# EAGLE design thruster_control (EAGLE 7.2.0)
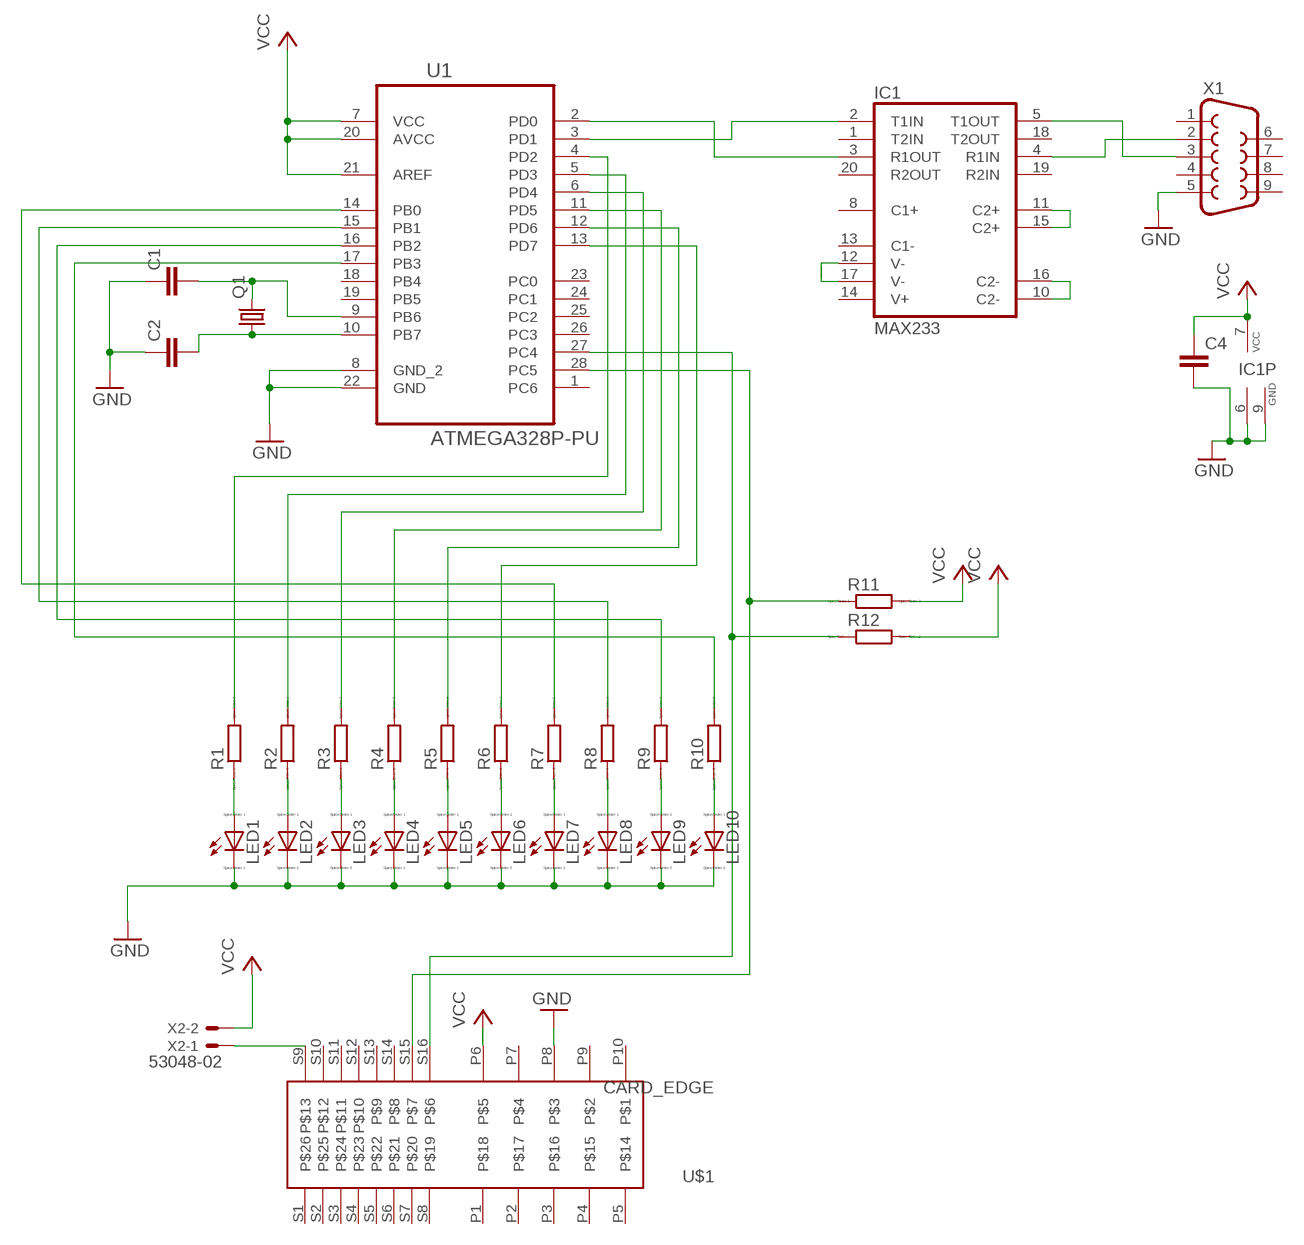
[diagram p0: schematic, sheet 1]

## Parts
C1  C2.5/4  [C2.5-4]
C2  C2.5/4  [C2.5-4]
C4  C2.5/4  [C2.5-4]
IC1  MAX233  [DIL20]
LED1  LED_ELD260  [LED_LD260]
LED2  LED_ELD260  [LED_LD260]
LED3  LED_ELD260  [LED_LD260]
LED4  LED_ELD260  [LED_LD260]
LED5  LED_ELD260  [LED_LD260]
LED6  LED_ELD260  [LED_LD260]
LED7  LED_ELD260  [LED_LD260]
LED8  LED_ELD260  [LED_LD260]
LED9  LED_ELD260  [LED_LD260]
LED10  LED_ELD260  [LED_LD260]
Q1  CRYSTALHC49S  [HC49/S]
R1  R0204/7  [0204/7]
R2  R0204/7  [0204/7]
R3  R0204/7  [0204/7]
R4  R0204/7  [0204/7]
R5  R0204/7  [0204/7]
R6  R0204/7  [0204/7]
R7  R0204/7  [0204/7]
R8  R0204/7  [0204/7]
R9  R0204/7  [0204/7]
R10  R0204/7  [0204/7]
R11  R0204/7  [0204/7]
R12  R0204/7  [0204/7]
U1  ATMEGA328P-PU  [DIP254P762X457-28]
U$1  CARD_EDGE  [EDGE_CONNECTOR]
X1  F09HP  [F09HP]
X2  53048-02  [53048-02]

## Nets
GND: C1.1 C2.1 C4.2 IC1.6(GND) IC1.9(GND) LED1.K(C) LED2.K(C) LED3.K(C) LED4.K(C) LED5.K(C) LED6.K(C) LED7.K(C) LED8.K(C) LED9.K(C) LED10.K(C) U1.8(GND_2) U1.22(GND) X1.5
N$1: LED1.A R1.1
N$2: LED2.A R2.1
N$3: LED3.A R3.1
N$4: LED4.A R4.1
N$5: LED5.A R5.1
N$6: LED6.A R6.1
N$7: LED7.A R7.1
N$8: LED8.A R8.1
N$9: LED9.A R9.1
N$10: LED10.A R10.1
N$11: C2.2 Q1.1 U1.10(PB7)
N$12: C1.2 Q1.2 U1.9(PB6)
N$13: R1.2 U1.4(PD2)
N$14: R2.2 U1.5(PD3)
N$15: R3.2 U1.6(PD4)
N$16: R4.2 U1.11(PD5)
N$17: R5.2 U1.12(PD6)
N$18: R6.2 U1.13(PD7)
N$19: R7.2 U1.14(PB0)
N$20: R8.2 U1.15(PB1)
N$21: R9.2 U1.16(PB2)
N$22: R10.2 U1.17(PB3)
N$23: IC1.5(T1OUT) X1.3
N$24: IC1.11(C2+) IC1.15(C2+)
N$25: IC1.10(C2-) IC1.16(C2-)
N$26: IC1.2(T1IN) U1.3(PD1)
N$27: IC1.3(R1OUT) U1.2(PD0)
N$28: IC1.4(R1IN) X1.2
N$29: R12.1 U1.27(PC4) U$1.S16
N$30: R11.1 U1.28(PC5) U$1.S15
N$31: IC1.12(V-) IC1.17(V-)
N$32: U$1.S9 X2.1
N$34: U$1.P8 ; supply symbol labelled GND
VCC: C4.1 IC1.7(VCC) R11.2 R12.2 U1.7(VCC) U1.20(AVCC) U1.21(AREF) U$1.P6 X2.2
Unconnected: IC1.1(T2IN) IC1.8(C1+) IC1.13(C1-) IC1.14(V+) IC1.18(T2OUT) IC1.19(R2IN) IC1.20(R2OUT) U1.1(PC6) U1.18(PB4) U1.19(PB5) U1.23(PC0) U1.24(PC1) U1.25(PC2) U1.26(PC3) U$1.P1 U$1.P2 U$1.P3 U$1.P4 U$1.P5 U$1.P7 U$1.P9 U$1.P10 U$1.S1 U$1.S2 U$1.S3 U$1.S4 U$1.S5 U$1.S6 U$1.S7 U$1.S8 U$1.S10 U$1.S11 U$1.S12 U$1.S13 U$1.S14 X1.1 X1.4 X1.6 X1.7 X1.8 X1.9

## Library data of the parts
C1 C2 C4 = capacitor-wima:C: CAPACITOR naming: grid - package width
IC1 = maxim:MAX233: RS232 TRANSCEIVER; MPN: MAX233ACPP+G36; OC_FARNELL: 1593332; OC_NEWARK: 89K3459
LED1-LED10 = eagle-ltspice:LED_E: LED Source: http://www.osram.convergy.de Source: www.luxeon.com Source: www.kingbright.com; SPICEMODEL: NONE; SPICEPREFIX: D; SPICETYPE: diode
Q1 = crystal:CRYSTAL: CRYSTAL; OC_FARNELL: 1667008; OC_NEWARK: unknown
R1-R12 = eagle-ltspice:R: RESISTOR, European symbol; SPICEMODEL: NONE; SPICEPREFIX: R
U1 = Atmel_By_element14_Batch_1-00:ATMEGA328P-PU: 8-bit Microcontroller with In-System Programmable Flash; MPN: ATMEGA328P-PU; OC_FARNELL: 1715487; OC_NEWARK: 15R0268; PACKAGE: PDIP-28; SUPPLIER: Atmel
U$1 = molex_edge:CARD_EDGE
X1 = con-subd:F09: SUB-D; OC_FARNELL: unknown; OC_NEWARK: unknown
X2 = con-molex:53?-02: CONNECTOR wire to board 1.25 mm (.049 inch) pitch header; MF: MOLEX; MPN: 53048-0210; OC_FARNELL: 1012259; OC_NEWARK: 57H4718

## Net classes
0 default: clearance 0.205 mm

## Board
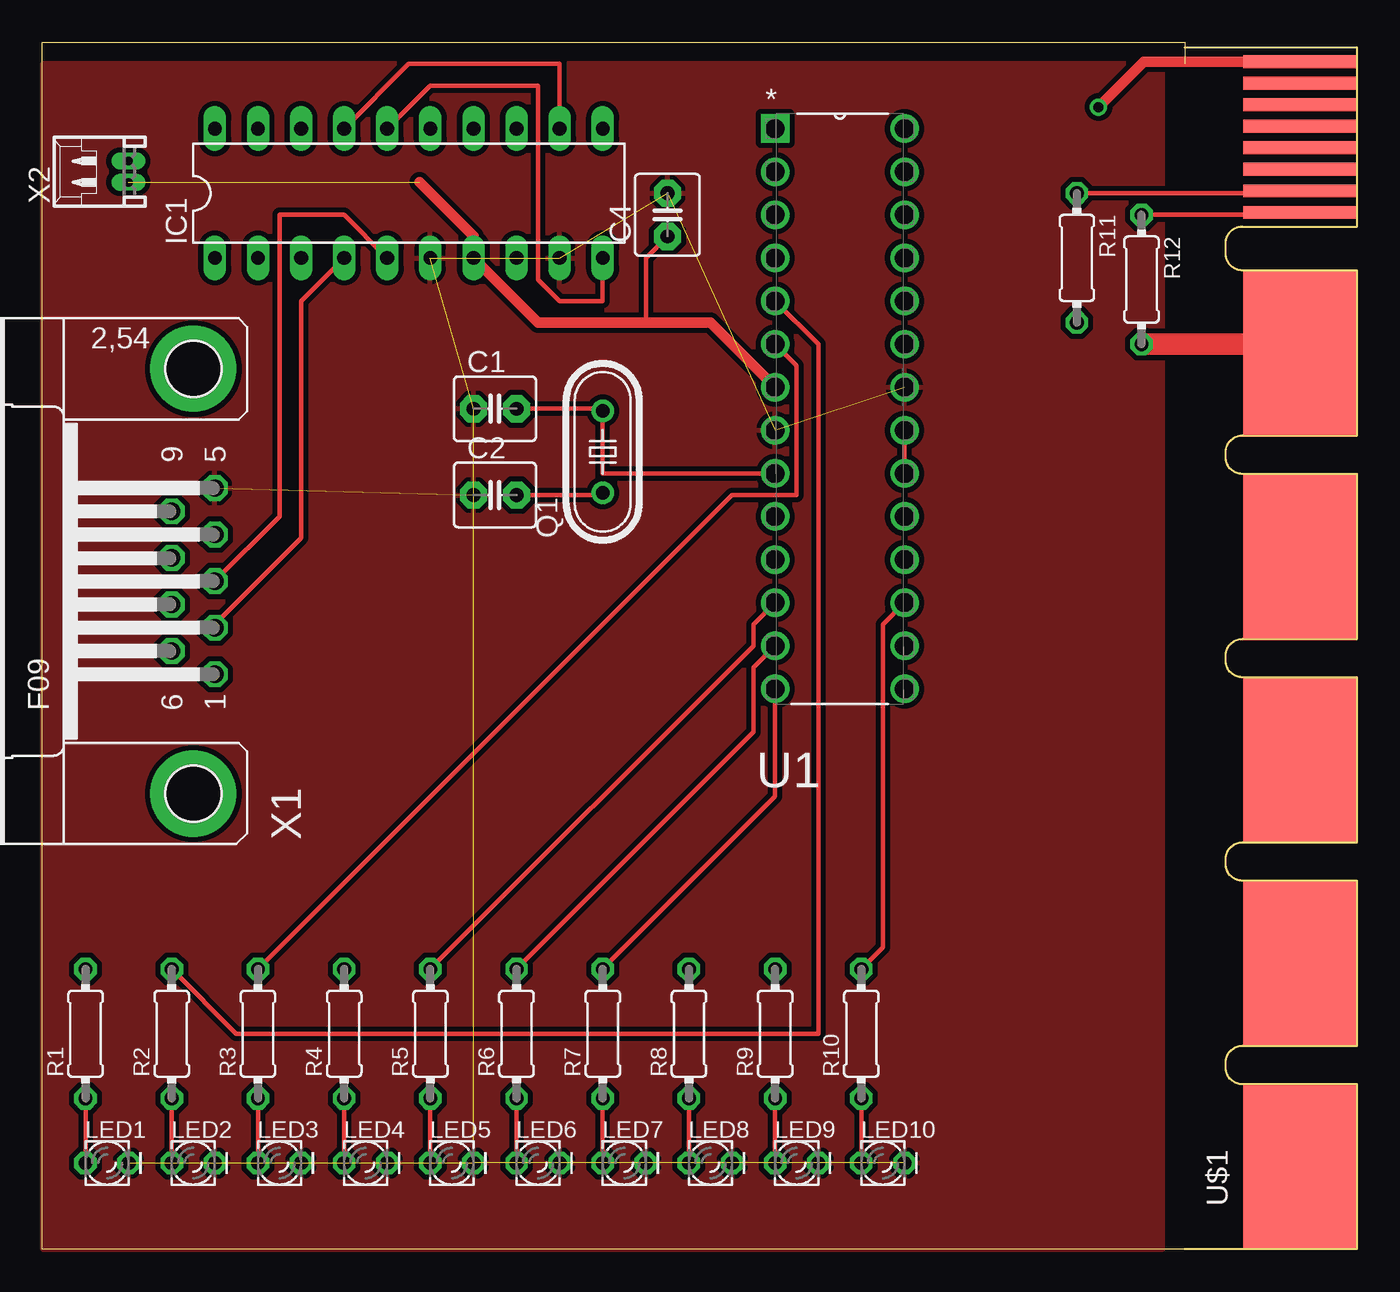
[diagram p1: board, top side]
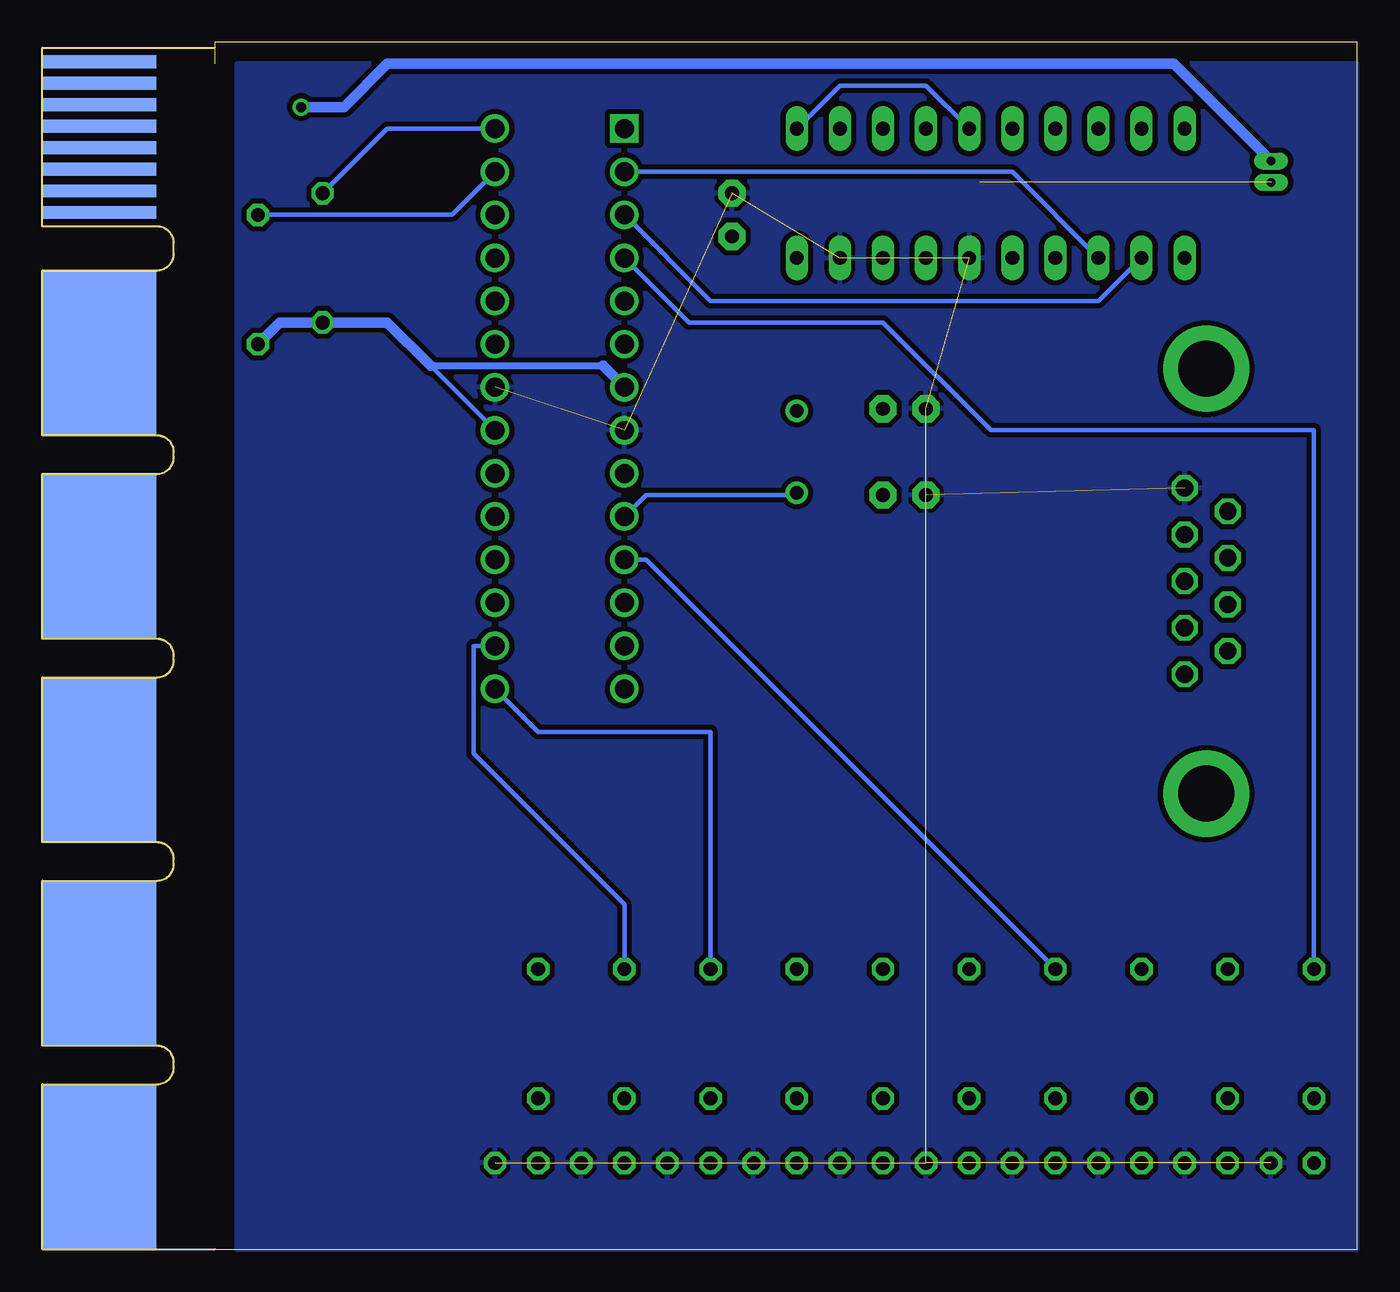
[diagram p2: board, bottom side, seen from below]

Size 77.47 x 71.12 mm. Coordinates in mm from the lower left corner, seen from the top.
Outline: 67.31,0 0,0 0,71.12 67.31,71.12 67.31,69.85
Copper layers (1*16): Top 0.035mm / dielectric 1.5mm / Bottom 0.035mm
Design rules "default *": minimum track width 10mil, minimum drill 24mil, track to track 8mil, track to pad 8mil, pad to pad 8mil, via to via 8mil, smd to smd 8mil, copper to edge 0mil, drill to drill 8mil, minimum pad ring 10mil, minimum via ring 8mil, stop-mask expansion 4mil, vias tented up to drill 0mil, thermal gap 10mil

### Footprints (pad centres in the part's own frame; a part is rotated, then mirrored left to right if it is on the bottom)
C2.5-4 = drill 0.813 pad 1.6 octagon: 1 -1.27,0; 2 1.27,0
DIL20 = drill 0.813 long: 1 -11.43,-3.81; 2 -8.89,-3.81; 3 -6.35,-3.81; 4 -3.81,-3.81; 5 -1.27,-3.81; 6 1.27,-3.81; 7 3.81,-3.81; 8 6.35,-3.81; 9 8.89,-3.81; 10 11.43,-3.81; 11 11.43,3.81; 12 8.89,3.81; 13 6.35,3.81; 14 3.81,3.81; 15 1.27,3.81; 16 -1.27,3.81; 17 -3.81,3.81; 18 -6.35,3.81; 19 -8.89,3.81; 20 -11.43,3.81
LED_LD260 = drill 0.813 octagon: A -1.27,0; K 1.27,0
HC49/S = drill 0.813: 1 -2.413,0; 2 2.413,0
0204/7 = drill 0.813 octagon: 1 -3.81,0; 2 3.81,0
DIP254P762X457-28 = drill 1.118 square: 1 -7.62,33.02 | drill 1.118: 2 -7.62,30.48; 3 -7.62,27.94; 4 -7.62,25.4; 5 -7.62,22.86; 6 -7.62,20.32; 7 -7.62,17.78; 8 -7.62,15.24; 9 -7.62,12.7; 10 -7.62,10.16; 11 -7.62,7.62; 12 -7.62,5.08; 13 -7.62,2.54; 14 -7.62,0; 15 0,0; 16 0,2.54; 17 0,5.08; 18 0,7.62; 19 0,10.16; 20 0,12.7; 21 0,15.24; 22 0,17.78; 23 0,20.32; 24 0,22.86; 25 0,25.4; 26 0,27.94; 27 0,30.48; 28 0,33.02
EDGE_CONNECTOR = smd 9.728 x 6.706 bottom: P1 52.87,3.35; P2 40.87,3.35; P3 28.87,3.35; P4 16.87,3.35 | smd 9.73 x 6.7 bottom: P5 4.87,3.35 | smd 9.728 x 6.706: P6 52.87,3.35; P7 40.87,3.35; P8 28.87,3.35; P9 16.87,3.35 | smd 9.73 x 6.7: P10 4.87,3.35 | smd 0.76 x 6.7 bottom: S1 69.99,3.35; S2 68.72,3.35; S3 67.45,3.35; S4 66.18,3.35; S5 64.91,3.35; S6 63.64,3.35; S7 62.37,3.35; S8 61.1,3.35 | smd 0.76 x 6.7: S9 69.99,3.35; S10 68.72,3.35; S11 67.45,3.35; S12 66.18,3.35; S13 64.91,3.35; S14 63.64,3.35; S15 62.37,3.35; S16 61.1,3.35
F09HP = drill 1.016 octagon: 1 -5.486,-1.27; 2 -2.743,-1.27; 3 0,-1.27; 4 2.743,-1.27; 5 5.486,-1.27; 6 -4.115,1.27; 7 -1.372,1.27; 8 1.372,1.27; 9 4.115,1.27 | drill 3.302 pad 5.08: G1 -12.522,0; G2 12.522,0
53048-02 = drill 0.5 pad 0.698 long: 1 0.625,-1.25; 2 -0.625,-1.25

### Placement (x,y rotation side)
C1  26.67,49.53 0 top
C2  26.67,44.45 0 top
C4  36.83,60.96 90 top
IC1  21.59,62.23 0 top
LED1  3.81,5.08 0 top
LED2  8.89,5.08 0 top
LED3  13.97,5.08 0 top
LED4  19.05,5.08 0 top
LED5  24.13,5.08 0 top
LED6  29.21,5.08 0 top
LED7  34.29,5.08 0 top
LED8  39.37,5.08 0 top
LED9  44.45,5.08 0 top
LED10  49.53,5.08 0 top
Q1  33.02,46.99 90 top
R1  2.54,12.7 90 top
R2  7.62,12.7 90 top
R3  12.7,12.7 90 top
R4  17.78,12.7 90 top
R5  22.86,12.7 90 top
R6  27.94,12.7 90 top
R7  33.02,12.7 90 top
R8  38.1,12.7 90 top
R9  43.18,12.7 90 top
R10  48.26,12.7 90 top
R11  60.96,58.42 270 top
R12  64.77,57.15 270 top
U1  50.8,33.02 0 top
U$1  77.47,0 90 top
X1  8.89,39.37 90 top
X2  3.81,63.5 90 top

### Tracks (layer width: path | path; a pad name or v marks a point on that pad's centre or on a via)
GND  (17 unrouted)
  pour Top (isolate 0.305): 66.04,69.85 0,69.85 0,0 66.04,0
  pour Bottom (isolate 0.305): 0,69.85 66.04,69.85 66.04,0 0,0
N$1
  Top 0.254: R1.1 LED1.A
N$2
  Top 0.254: R2.1 LED2.A
N$3
  Top 0.254: R3.1 LED3.A
N$4
  Top 0.254: R4.1 LED4.A
N$5
  Top 0.254: R5.1 LED5.A
N$6
  Top 0.254: R6.1 LED6.A
N$7
  Top 0.254: R7.1 LED7.A
N$8
  Top 0.254: R8.1 LED8.A
N$9
  Top 0.254: R9.1 LED9.A
N$10
  Top 0.254: R10.1 LED10.A
N$11
  Top 0.254: C2.2 33.02,44.45 Q1.1
  Bottom 0.254: U1.10 41.91,44.45 33.02,44.45 Q1.1
N$12
  Top 0.254: C1.2 33.02,49.53 Q1.2 33.02,45.72 U1.9
N$13
  Bottom 0.254: R1.2 2.54,48.26 21.59,48.26 27.94,54.61 39.37,54.61 U1.4
N$14
  Top 0.254: R2.2 11.43,12.7 45.72,12.7 45.72,53.34 U1.5
N$15
  Top 0.254: R3.2 40.64,44.45 44.45,44.45 44.45,52.07 U1.6
N$16
  Bottom 0.254: R4.2 41.91,40.64 U1.11
N$17
  Top 0.254: R5.2 41.91,35.56 41.91,36.83 U1.12
N$18
  Top 0.254: R6.2 41.91,30.48 41.91,34.29 U1.13
N$19
  Top 0.254: R7.2 43.18,26.67 U1.14
N$20
  Bottom 0.254: R8.2 38.1,30.48 48.26,30.48 U1.15
N$21
  Bottom 0.254: R9.2 43.18,20.32 52.07,29.21 52.07,35.56 U1.16
N$22
  Top 0.254: R10.2 49.53,17.78 49.53,36.83 U1.17
N$23
  Top 0.254: IC1.5 17.78,60.96 13.97,60.96 13.97,43.18 X1.3
N$24
  Bottom 0.254: IC1.15 25.4,68.58 30.48,68.58 IC1.11
N$25
  Top 0.254: IC1.16 22.86,68.58 29.21,68.58 29.21,57.15 30.48,55.88 33.02,55.88 IC1.10
N$26
  Bottom 0.254: IC1.2 15.24,55.88 38.1,55.88 U1.3
N$27
  Bottom 0.254: IC1.3 20.32,63.5 U1.2
N$28
  Top 0.254: IC1.4 15.24,55.88 15.24,41.91 10.16,36.83 X1.2
N$29
  Top 0.254: R12.1 73.66,60.96 U$1.S16
  Bottom 0.254: U1.27 53.34,60.96 R12.1
N$30
  Top 0.254: R11.1 73.66,62.23 U$1.S15
  Bottom 0.254: R11.1 57.15,66.04 U1.28
N$31
  Top 0.254: IC1.17 21.59,69.85 30.48,69.85 IC1.12
N$32  (via drill 0.6)
  Top 0.61: U$1.S9 64.91,69.99 v62.23,67.31
  Bottom 0.61: v62.23,67.31 59.69,67.31 57.15,69.85 10.79,69.85 X2.1
N$33  (via drill 0.6)
  other vias: 62.23,67.31
VCC  (1 unrouted)
  Top 0.254: U1.21 U1.20 | 73.66,53.34 U$1.P6 | C4.1 35.56,58.42 35.56,54.61
  Top 0.305: 36.83,54.61 35.56,54.61
  Top 0.61: U1.7 39.37,54.61 35.56,54.61 29.21,54.61 IC1.7 25.4,59.69 22.21,62.88
  Top 1.27: R12.2 73.66,53.34
  Bottom 0.254: 54.61,52.07 U1.21
  Bottom 0.406: 54.61,52.07 44.45,52.07
  Bottom 0.61: R12.2 63.5,54.61 R11.2 57.15,54.61 54.61,52.07 | 44.45,52.07 U1.7